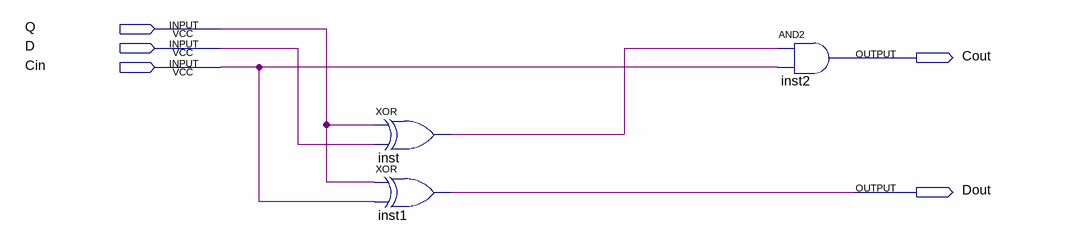
[diagram p0: schematic sheet]
// Quartus schematic has.bdf as structural Verilog: 3 symbols, 5 pins
module has (
  input  Q,
  input  D,
  input  Cin,
  output Cout,
  output Dout
);

  wire inst_out;

  xor inst (inst_out, Q, D);
  xor inst1 (Dout, Q, Cin);
  and inst2 (Cout, inst_out, Cin);
endmodule
